# EAGLE design sensor-tiny2313a (EAGLE 6.4)
Assembly variants: LCD, NOLCD
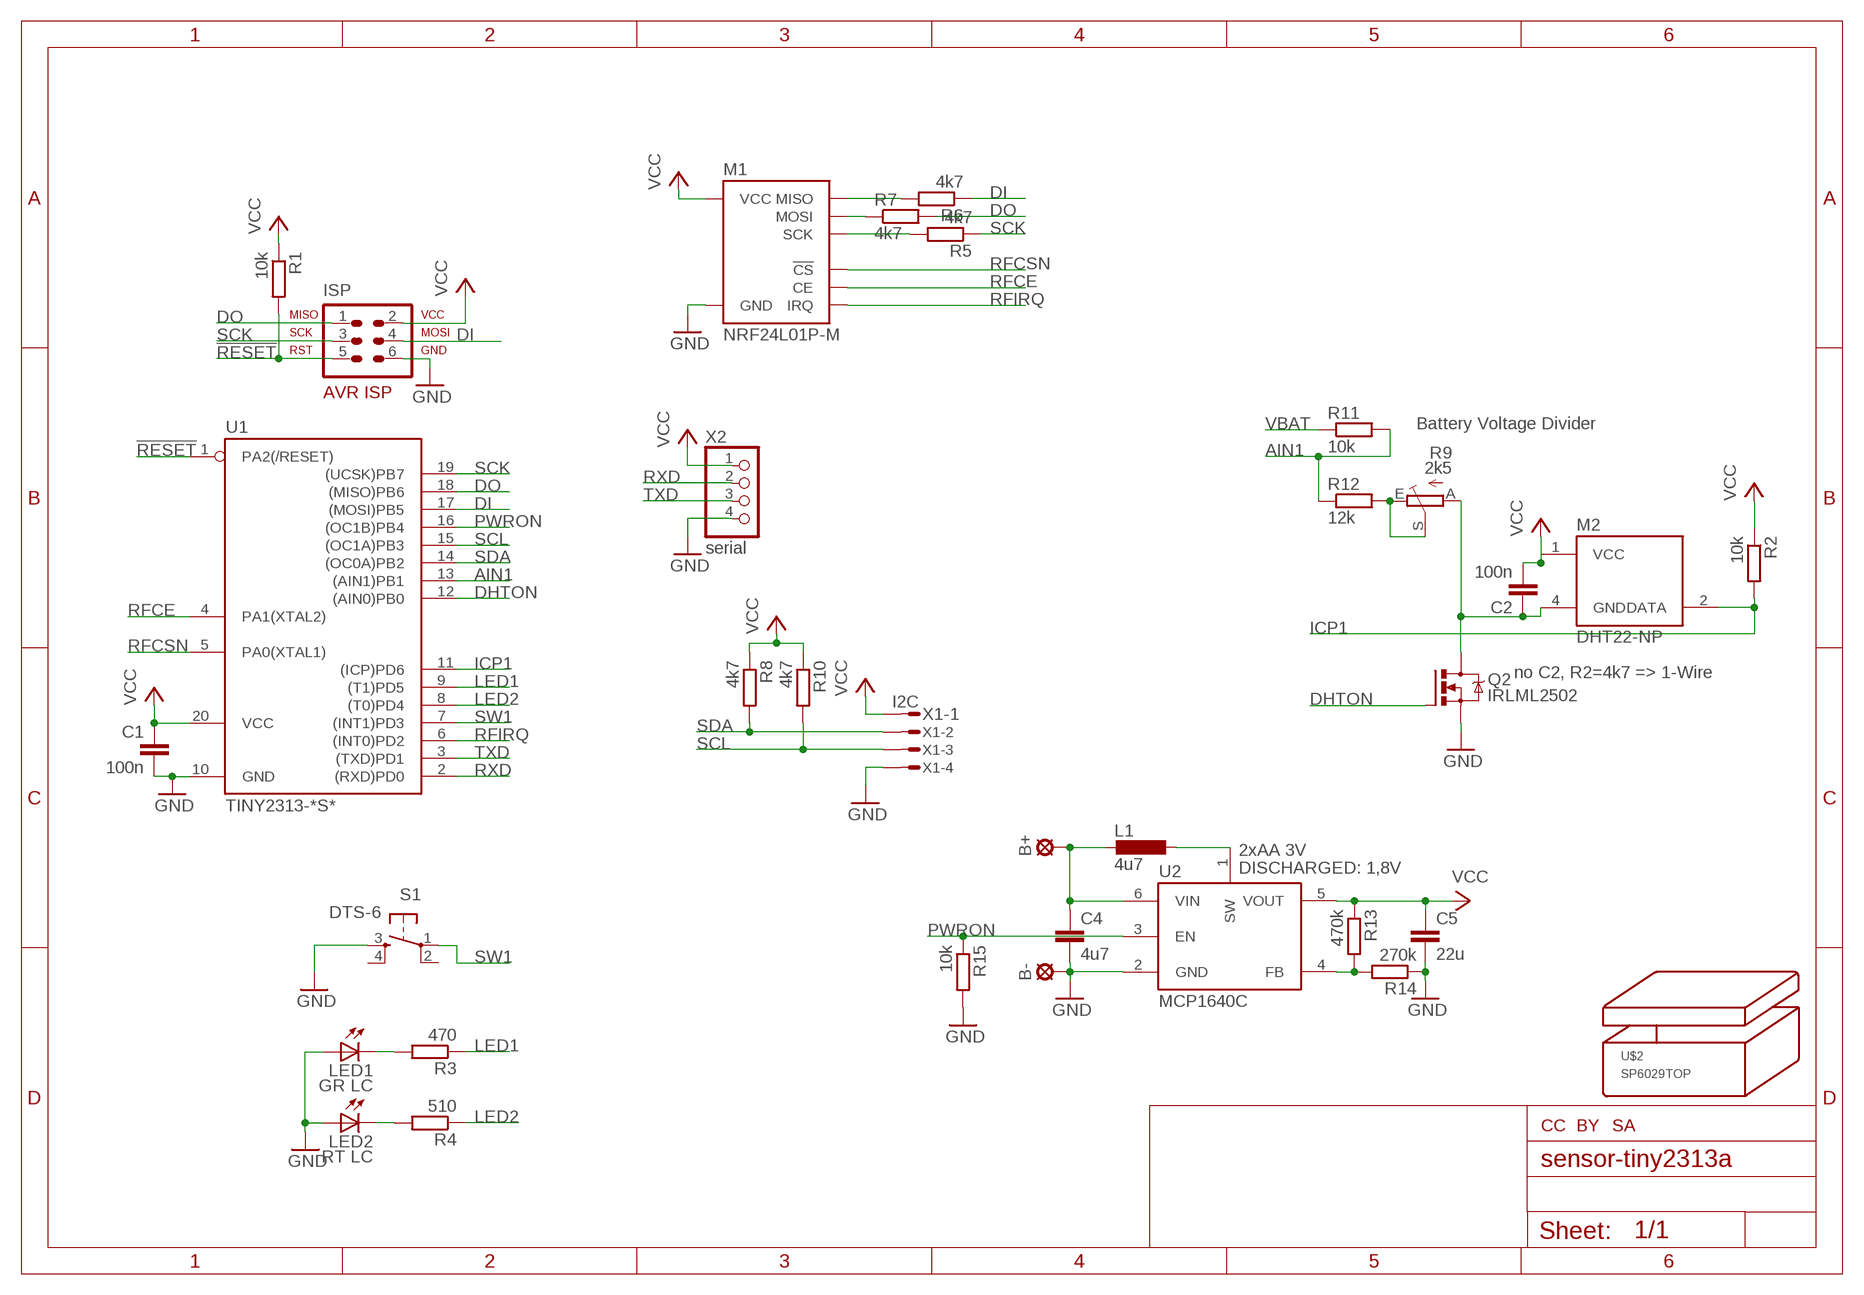
[diagram p0: schematic, sheet 1]

## Parts
B+  LSP11  [LSP11]
B-  LSP11  [LSP11]
C1  100n  C-EUC0603  [C0603]
C2  100n  C-EUC0603  [C0603]
C4  4u7  C-EUC0805  [C0805]
C5  22u  C-EUC1206  [C1206]
ISP  ML6  AVR-ISP-6VERT  [AVR-ISP-6]
L1  4u7  L-EUPISG  [PISG]
LED1  GR LC  LED5MM  [LED5MM]
LED2  RT LC  LED5MM  [LED5MM]
M1  NRF24L01P-M  [NRF24L01P-A]
M2  DHT22-NP  [DHT22-NOPRINT]
Q2  IRLML2502  [MICRO3]
R1  10k  R-EU_R0603  [R0603]
R2  10k  R-EU_R0603  [R0603]
R3  470  R-EU_R0603  [R0603]
R4  510  R-EU_R0603  [R0603]
R5  4k7  R-EU_R0603  [R0603]
R6  4k7  R-EU_R0603  [R0603]
R7  4k7  R-EU_R0603  [R0603]
R8  4k7  R-EU_R0603  [R0603]
R9  2k5  TRIM_EU-CA6H  [CA6H]
R10  4k7  R-EU_R0603  [R0603]
R11  10k  R-EU_R0603  [R0603]
R12  12k  R-EU_R0603  [R0603]
R13  470k  R-EU_R0603  [R0603]
R14  270k  R-EU_R0603  [R0603]
R15  10k  R-EU_R0603  [R0603]
S1  DTS-6  [DTS-6]
U1  TINY2313-*S*  [SO20L$]
U2  MCP1640C  MCP1640  [SOT23-6]
U$1  CC-TPLACE-HALF  [CC_TPLACE_HS]
U$2  SP6029TOP  [SP6029T]
U$3  BY-TPLACE-HS  [BY_TPLACE_HS]
U$4  SA-TPLACE-HALF  [SA_TPLACE_HS]
X1  I2C  MICROMATCH-4  [MICROMATCH-4]
X2  serial  PINHD-1X4_2.54  [1X04]

## Nets
!RESET: ISP.5 R1.2 U1.1(PA2(/RESET))
AIN1: R11.2 R12.1 U1.13((AIN1)PB1)
DHTON: Q2.1(G) U1.12((AIN0)PB0)
DI: ISP.4 R6.1 U1.17((MOSI)PB5)
DO: ISP.1 R7.2 U1.18((MISO)PB6)
GND [pwr]: B-.MP C1.2 C4.2 C5.2 ISP.6 LED1.A LED2.A M1.GND_A(GND) M1.GND_B(GND) Q2.2(S) R14.1 R15.2 S1.3 U1.10(GND) U2.2(GND) X1.4 X2.4
ICP1: M2.2(DATA) R2.2 U1.11((ICP)PD6)
LED1: R3.1 U1.9((T1)PD5)
LED2: R4.1 U1.8((T0)PD4)
N$1: LED2.K(C) R4.2
N$2: C2.1 M2.4(GND) Q2.3(D) R9.A
N$3: LED1.K(C) R3.2
N$7: R9.E R9.S R12.2
N$8: L1.1 U2.1(SW)
N$9: R13.2 R14.2 U2.4(FB)
PWRON: R15.1 U1.16((OC1B)PB4) U2.3(EN)
RDI: M1.MISO R6.2
RDO: M1.MOSI R7.1
RFCE: M1.CE U1.4(PA1(XTAL2))
RFCSN: M1.CSN(!CS) U1.5(PA0(XTAL1))
RFIRQ: M1.IRQ U1.6((INT0)PD2)
RSCK: M1.SCK R5.2
RXD: U1.2((RXD)PD0) X2.2
SCK: ISP.3 R5.1 U1.19((UCSK)PB7)
SCL: R10.2 U1.15((OC1A)PB3) X1.3
SDA: R8.2 U1.14((OC0A)PB2) X1.2
SW1: S1.1 U1.7((INT1)PD3)
TXD: U1.3((TXD)PD1) X2.3
VBAT [pwr]: B+.MP C4.1 L1.2 R11.1 U2.6(VIN)
VCC [pwr]: C1.1 C2.2 C5.1 ISP.2 M1.VCC_A(VCC) M1.VCC_B(VCC) M2.1(VCC) R1.1 R2.1 R8.1 R10.1 R13.1 U1.20(VCC) U2.5(VOUT) X1.1 X2.1
Unconnected: S1.2 S1.4

## Notes on the sheet
- Battery Voltage Divider
- no C2, R2=4k7 => 1-Wire
- 2xAA 3V
- DISCHARGED: 1,8V

## Library data of the parts
B+ B- = solpad:LSP11: SOLDER PAD drill 1.1 mm
C1 C2 = rcl:C-EU: CAPACITOR, European symbol
C4 = rcl:C-EU: CAPACITOR, European symbol; _REICHELT_: X7R-G0805 4,7/16
C5 = rcl:C-EU: CAPACITOR, European symbol; _REICHELT_: X7R-G1206 22/10
ISP = avr-7:AVR-ISP-6: AVR ISP-6 Serial Programming Header
L1 = inductor-Fastron:L-EU; _REICHELT_: L-PISG 4,7µ
LED1 = led:LED: LED OSRAM: - CHIPLED LG R971, LG N971, LY N971, LG Q971, LY Q971, LO R971, LY R971 LH N974, LH R974 LS Q976, LO Q976, LY Q976 LO Q996 - Hyper CHIPLED LW Q18S LB Q993, LB Q99A, LB R99A - SideLED LS A670, LO A670, LY A670, LG A670, LP A670 LB A673, LV A673, LT A673, LW A673 LH A674 LY A675 LS A676, LA A676, LO A676, LY A676, LW A676 LS A679, LY A679, LG A679 - Hyper Micro SIDELED® LS Y876, LA Y876, LO Y876, LY Y876 LT Y87S - SmartLED LW L88C, LW L88S LB L89C, LB L89S, LG L890 LS L89K, LO L89K, LY L89K LS L896, LA L896, LO L896, LY L896 - TOPLED LS T670, LO T670, LY T670, LG T670, LP T670 LSG T670, LSP T670, LSY T670, LOP T670, LYG T670 LG T671, LOG T671, LSG T671 LB T673, LV T673, LT T673, LW T673 LH T674 LS T676, LA T676, LO T676, LY T676, LB T676, LH T676, LSB T676, LW T676 LB T67C, LV T67C, LT T67C, LS T67K, LO T67K, LY T67K, LW E67C LS E67B, LA E67B, LO E67B, LY E67B, LB E67C, LV E67C, LT E67C LW T67C LS T679, LY T679, LG T679 LS T770, LO T770, LY T770, LG T770, LP T770 LB T773, LV T773, LT T773, LW T773 LH T774 LS E675, LA E675, LY E675, LS T675 LS T776, LA T776, LO T776, LY T776, LB T776 LHGB T686 LT T68C, LB T68C - Hyper Mini TOPLED® LB M676 - Mini TOPLED Santana® LG M470 LS M47K, LO M47K, LY M47K Source: http://www.osram.convergy.de LUXEON: - LUMILED® LXK2-PW12-R00, LXK2-PW12-S00, LXK2-PW14-U00, LXK2-PW14-V00 LXK2-PM12-R00, LXK2-PM12-S00, LXK2-PM14-U00 LXK2-PE12-Q00, LXK2-PE12-R00, LXK2-PE12-S00, LXK2-PE14-T00, LXK2-PE14-U00 LXK2-PB12-K00, LXK2-PB12-L00, LXK2-PB12-M00, LXK2-PB14-N00, LXK2-PB14-P00, LXK2-PB14-Q00 LXK2-PR12-L00, LXK2-PR12-M00, LXK2-PR14-Q00, LXK2-PR14-R00 LXK2-PD12-Q00, LXK2-PD12-R00, LXK2-PD12-S00 LXK2-PH12-R00, LXK2-PH12-S00 LXK2-PL12-P00, LXK2-PL12-Q00, LXK2-PL12-R00 Source: www.luxeon.com KINGBRIGHT: KA-3528ASYC Source: www.kingbright.com; I: 2.2mA; U_F: 2V2
LED2 = led:LED: LED OSRAM: - CHIPLED LG R971, LG N971, LY N971, LG Q971, LY Q971, LO R971, LY R971 LH N974, LH R974 LS Q976, LO Q976, LY Q976 LO Q996 - Hyper CHIPLED LW Q18S LB Q993, LB Q99A, LB R99A - SideLED LS A670, LO A670, LY A670, LG A670, LP A670 LB A673, LV A673, LT A673, LW A673 LH A674 LY A675 LS A676, LA A676, LO A676, LY A676, LW A676 LS A679, LY A679, LG A679 - Hyper Micro SIDELED® LS Y876, LA Y876, LO Y876, LY Y876 LT Y87S - SmartLED LW L88C, LW L88S LB L89C, LB L89S, LG L890 LS L89K, LO L89K, LY L89K LS L896, LA L896, LO L896, LY L896 - TOPLED LS T670, LO T670, LY T670, LG T670, LP T670 LSG T670, LSP T670, LSY T670, LOP T670, LYG T670 LG T671, LOG T671, LSG T671 LB T673, LV T673, LT T673, LW T673 LH T674 LS T676, LA T676, LO T676, LY T676, LB T676, LH T676, LSB T676, LW T676 LB T67C, LV T67C, LT T67C, LS T67K, LO T67K, LY T67K, LW E67C LS E67B, LA E67B, LO E67B, LY E67B, LB E67C, LV E67C, LT E67C LW T67C LS T679, LY T679, LG T679 LS T770, LO T770, LY T770, LG T770, LP T770 LB T773, LV T773, LT T773, LW T773 LH T774 LS E675, LA E675, LY E675, LS T675 LS T776, LA T776, LO T776, LY T776, LB T776 LHGB T686 LT T68C, LB T68C - Hyper Mini TOPLED® LB M676 - Mini TOPLED Santana® LG M470 LS M47K, LO M47K, LY M47K Source: http://www.osram.convergy.de LUXEON: - LUMILED® LXK2-PW12-R00, LXK2-PW12-S00, LXK2-PW14-U00, LXK2-PW14-V00 LXK2-PM12-R00, LXK2-PM12-S00, LXK2-PM14-U00 LXK2-PE12-Q00, LXK2-PE12-R00, LXK2-PE12-S00, LXK2-PE14-T00, LXK2-PE14-U00 LXK2-PB12-K00, LXK2-PB12-L00, LXK2-PB12-M00, LXK2-PB14-N00, LXK2-PB14-P00, LXK2-PB14-Q00 LXK2-PR12-L00, LXK2-PR12-M00, LXK2-PR14-Q00, LXK2-PR14-R00 LXK2-PD12-Q00, LXK2-PD12-R00, LXK2-PD12-S00 LXK2-PH12-R00, LXK2-PH12-S00 LXK2-PL12-P00, LXK2-PL12-Q00, LXK2-PL12-R00 Source: www.luxeon.com KINGBRIGHT: KA-3528ASYC Source: www.kingbright.com; I: 2mA; U_F: 2V
M1 = modules:NRF24L01P-M
M2 = modules:DHT22
Q2 = mosfet:IRLML2502: HEXFET N-Channel Power MOSFET http://www.irf.com/product-info/datasheets/data/irlml2502.pdf
R1-R8 R10-R15 = rcl:R-EU_: RESISTOR, European symbol
R9 = pot:TRIM_EU-: POTENTIOMETER
S1 = switch-tact:DTS-6
U1 = avr-7:TINY2313*: Atmel Tiny2313 2K Flash, 128 bytes EEPROM, 128 bytes RAM
U2 = karlnet-parts:MCP1640: MCP1623, 1624, 1640/B/C/D pwm/pfm or pwm only DC/DC converters, in SOT-23
U$1 = creative-commons:CC: creatice commons - CC
U$2 = strapubox:SP6029: Gehäuse Strapubox Typ 6029 Montage Deckel max. Bauteilhöhe, top-layer: 7,5 mm max. Bauteilhöhe, bottom-layer: 10 mm (Dicke der LP: 1,5 mm) Montage Boden max. Bauteilhöhe, top-layer: 12,5 mm max. Bauteilhöhe, bottom-layer: 5 mm (Dicke der LP: 1,5 mm) Außenmaße: Länge: 80 mm Breite: 61 mm Höhe: 23 mm Innenmaße: Länge: 75 mm Breite: 56 mm Höhe: 19 mm Mit Batteriefach 2xAA/9V
U$3 = creative-commons:BY: creative commons Attribution - BY
U$4 = creative-commons:SA: creative commons ShareAlike - SA
X1 = con-amp-micromatch:MICROMATCH-4: MicroMaTch 4 7-215464-4 / 0-215464-4 Drawing Number C-215464 DDEController.pdf
X2 = pinhead-mod:PINHD-1X4: PIN HEADER

## Net classes
0 default: width 0.2 mm, drill 0.8 mm
1 pwr: width 0.25 mm, drill 0.8 mm

## Board
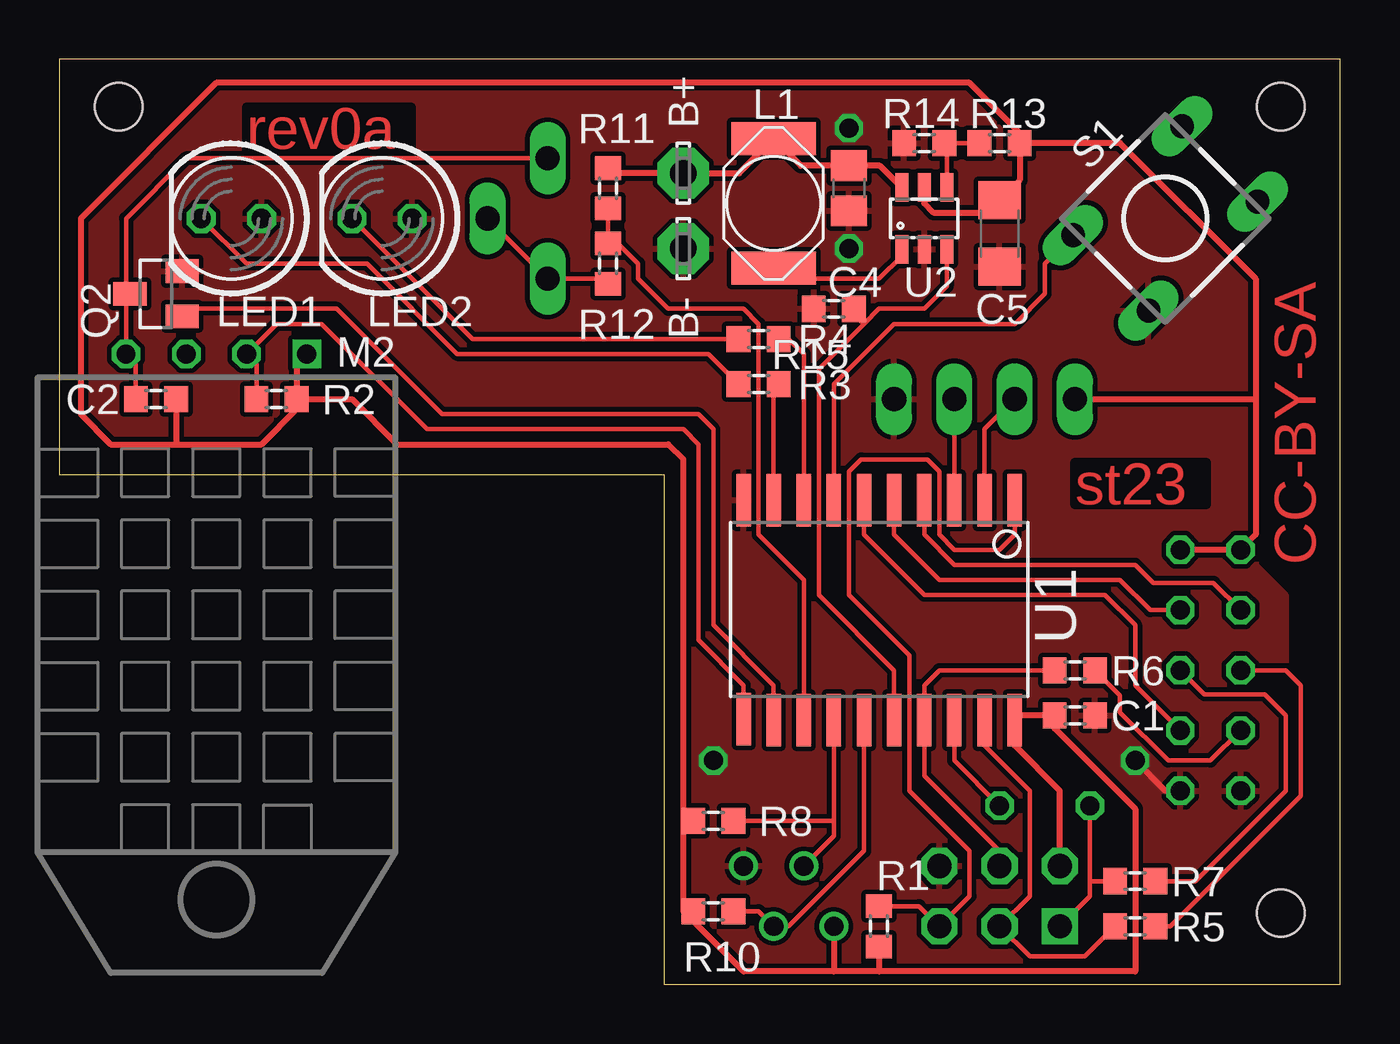
[diagram p1: board, top side]
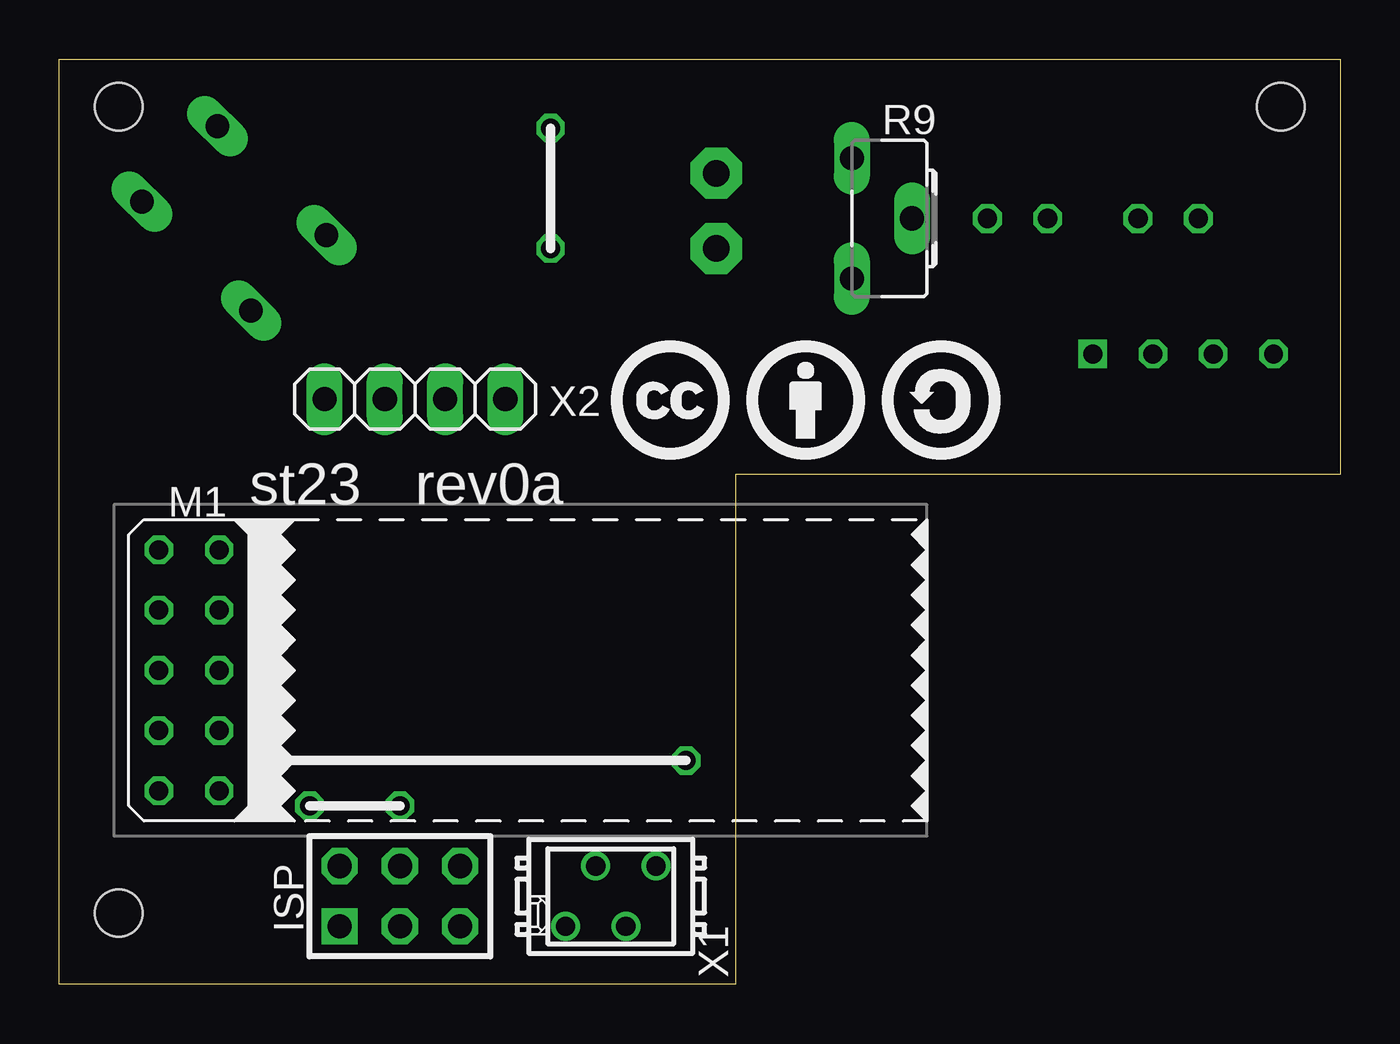
[diagram p2: board, bottom side, seen from below]

Size 54 x 39 mm. Coordinates in mm from the lower left corner, seen from the top.
Outline: 25.5,0 54,0 54,39 0,39 0,21.5 25.5,21.5 25.5,0
Copper layers (1*16): Top 0.035mm / dielectric 1.5mm / Bottom 0.035mm
Design rules "pcb-devboards_Standard *": minimum track width 0.2mm, minimum drill 0.4mm, track to track 0.2mm, track to pad 0.2mm, pad to pad 0.2mm, via to via 0.2mm, smd to smd 0.2mm, copper to edge 0.4mm, drill to drill 0.2mm, minimum pad ring 0.2mm, minimum via ring 0.2mm, stop-mask expansion 0.1mm, vias tented up to drill 0mil, thermal gap 0.2mm
Holes 2 mm at 51.5,3 51.5,37 2.5,37
bKeepout: area 23.5,23.5 to 30.8,30.5; area 25.5,30 to 28.5,36

### Footprints (pad centres in the part's own frame; a part is rotated, then mirrored left to right if it is on the bottom)
LSP11 = drill 1.118 pad 2.159 octagon: MP 0,0
C0603 = smd 1 x 1.1: 1 -0.85,0; 2 0.85,0
C0805 = smd 1.3 x 1.5: 1 -0.95,0; 2 0.95,0
C1206 = smd 1.6 x 1.8: 1 -1.4,0; 2 1.4,0
AVR-ISP-6 = drill 1.016 square: 1 -2.54,-1.27 | drill 1.016 octagon: 2 -2.54,1.27; 3 0,-1.27; 4 0,1.27; 5 2.54,-1.27; 6 2.54,1.27
PISG = smd 1.4 x 3.56: 1 -2.73,0; 2 2.73,0
LED5MM = drill 0.813 octagon: A -1.27,0; K 1.27,0
NRF24L01P-A = drill 0.8 octagon: CE -2.54,-1.27; CSN -2.54,1.27; GND_A 5.08,1.27; GND_B 5.08,-1.27; IRQ 2.54,1.27; MISO 2.54,-1.27; MOSI 0,1.27; SCK 0,-1.27; VCC_A -5.08,1.27; VCC_B -5.08,-1.27
DHT22-NOPRINT = drill 0.8 square: 1 -3.81,0 | drill 0.8 octagon: 2 -1.27,0; 3 1.27,0; 4 3.81,0
MICRO3 = smd 1 x 1.4: 1 -0.95,-1.1; 2 0.95,-1.1; 3 0,1.1
R0603 = smd 1 x 1.1: 1 -0.85,0; 2 0.85,0
CA6H = drill 1.016 long: A -2.54,0; E 2.54,0; S 0,2.54
DTS-6 = drill 1 long: 1 -3.25,2.25; 2 3.25,2.25; 3 -3.25,-2.25; 4 3.25,-2.25
SO20L$ = smd 0.61 x 2.21: 1 -5.715,-4.636; 2 -4.445,-4.636; 3 -3.175,-4.636; 4 -1.905,-4.636; 5 -0.635,-4.636; 6 0.635,-4.636; 7 1.905,-4.636; 8 3.175,-4.636; 9 4.445,-4.636; 10 5.715,-4.636; 11 5.715,4.61; 12 4.445,4.636; 13 3.175,4.636; 14 1.905,4.636; 15 0.635,4.636; 16 -0.635,4.636; 17 -1.905,4.636; 18 -3.175,4.636; 19 -4.445,4.636; 20 -5.715,4.636
SOT23-6 = smd 0.55 x 1.2: 1 -0.95,-1.3; 2 0,-1.3; 3 0.95,-1.3; 4 0.95,1.3; 5 0,1.3; 6 -0.95,1.3
MICROMATCH-4 = drill 0.813: 1 1.905,1.27; 2 0.635,-1.27; 3 -0.635,1.27; 4 -1.905,-1.27
1X04 = drill 1.016 long: 1 -3.81,0; 2 -1.27,0; 3 1.27,0; 4 3.81,0

### Placement (x,y rotation side)
B+  26.3,34.2 90 top
B-  26.3,31.02 90 top
C1  42.81,11.34 0 top
C2  4.08,24.67 0 top
C4  33.29,33.56 270 top
C5  39.64,31.66 270 top
ISP  39.64,3.71 0 bottom
L1  30.11,32.92 90 top
LED1  7.26,32.29 180 top
LED2  13.61,32.29 180 top
M1  48.53,13.24 270 bottom
M2  6.62,26.57 180 top
Q2  4.08,29.11 90 top
R1  34.56,2.45 90 top
R2  9.16,24.67 180 top
R3  29.48,25.3 180 top
R4  29.48,27.21 180 top
R5  45.35,2.45 0 top
R6  42.81,13.24 0 top
R7  45.35,4.35 180 top
R8  27.57,6.89 0 top
R9  20.59,32.29 270 bottom
R10  27.57,3.08 0 top
R11  23.13,33.56 270 top
R12  23.13,30.38 270 top
R13  39.64,35.47 180 top
R14  36.47,35.47 0 top
R15  32.66,28.48 180 top
S1  46.62,32.29 45 top
U1  34.56,15.78 180 top
U2  36.47,32.29 0 top
U$1  30.75,22.13 0 bottom
U$2  -1,-2 0 top
U$3  25.04,22.13 0 bottom
U$4  19.32,22.13 0 bottom
X1  30.75,3.71 180 bottom
X2  39.01,24.67 0 bottom

### Tracks (layer width: path | path; a pad name or v marks a point on that pad's centre or on a via)
!RESET
  Top 0.2: U1.1 40.27,18.95 39.64,18.32 37.73,18.32 37.1,18.95 37.1,21.62 36.59,22.13 33.8,22.13 33.29,21.62 33.29,16.41 35.83,13.88 35.83,8.16 38.37,5.62 38.37,3.71 ISP.5 36.25,3.29 R1.2
AIN1
  Top 0.2: R11.2 R12.1 23.55,31.23 24.4,30.38 24.4,29.75 25.67,28.48 28.84,28.48 29.48,27.84 29.48,18.95 31.38,17.05 U1.13
DHTON
  Top 0.2: U1.12 30.11,12.61 27.57,15.14 27.57,23.4 26.94,24.04 16.14,24.04 11.7,28.48 5.5,28.48 Q2.1
DI
  Top 0.2: R6.1 37.1,13.24 36.47,12.61 U1.17 36.47,8.79 39.64,5.62 ISP.4
DO  (via drill 0.8)
  Top 0.2: ISP.1 43.45,3.71 43.45,4.35 | 43.45,4.35 v43.45,7.53 | v39.64,7.53 37.73,9.43 U1.18 | R7.2 43.45,4.35
  Bottom 0.2: v43.45,7.53 v39.64,7.53
GND  (via drill 0.8)
  Top 0.25: M1.GND_A 46.62,8.16 v45.35,9.43
  Bottom 0.25: v33.29,36.1 v33.29,31.02 | v45.35,9.43 v27.57,9.43
  pour Top: -2.27,38.01 42.81,38.01 50.44,30.38 50.44,17.68 51.7,16.41 51.7,6.26 43.45,-2 -2.27,-2
ICP1
  Top 0.2: R2.2 8.31,26.16 M2.2 9.16,27.84 11.06,27.84 15.51,23.4 26.3,23.4 26.94,22.77 26.94,14.51 28.84,12.61 28.84,11.34 29.01,11.17 U1.11
LED1
  Top 0.2: U1.9 30.11,25.09 R3.1
LED2
  Top 0.2: U1.8 31.38,26.57 30.75,27.21 R4.1
N$1
  Top 0.2: R4.2 17.41,27.21 LED2.K
N$2
  Top 0.2: M2.4 3.23,26.16 C2.1 3.23,24.25 | M2.4 2.98,26.75 | R9.A 5.35,34.83 2.81,32.29 2.81,29.11 | 2.81,29.11 M2.4 | Q2.3 2.81,29.11
N$3
  Top 0.2: LED1.K 7.89,30.38 12.97,30.38 16.78,26.57 27.36,26.57 R3.2
N$7
  Top 0.2: R9.S R9.E 22.91,29.75 R12.2
N$8
  Top 0.2: U2.1 35.52,30.7 34.56,29.75 30.56,29.75 L1.1
N$9
  Top 0.2: U2.4 37.41,35.37 R14.2 R13.2
PWRON
  Top 0.2: U2.3 37.41,29.43 36.47,28.48 34.56,28.48 33.92,27.84 | U1.16 35.2,13.24 32.02,16.41 32.02,25.94 33.92,27.84 | R15.1 33.29,28.48 33.92,27.84
RDI
  Top 0.2: M1.MISO 48.53,9.43 46.75,9.43 44.72,11.46 44.72,12.19 R6.2
RDO
  Top 0.2: M1.MOSI 48.28,12.22 50.82,12.22 51.7,11.34 51.7,8.16 47.9,4.35 R7.1
RFCE
  Top 0.2: M1.CE 48.66,16.92 46.12,16.92 45.35,17.68 37.73,17.68 36.47,18.95 U1.4
RFCSN
  Top 0.2: M1.CSN 45.99,15.78 44.72,17.05 37.1,17.05 35.2,18.95 U1.5
RFIRQ
  Top 0.2: M1.IRQ 45.35,12.61 45.35,15.14 44.09,16.41 36.47,16.41 33.92,18.95 U1.6
RSCK
  Top 0.2: M1.SCK 51.7,13.24 52.34,12.61 52.34,7.95 46.84,2.45 R5.2
RXD
  Top 0.2: U1.2 39.01,23.4 X2.2
SCK
  Top 0.2: U1.19 39.01,10.06 40.91,8.16 40.91,3.71 ISP.3 40.91,1.17 43.23,1.17 R5.1
SCL
  Top 0.2: U1.15 33.92,5.62 30.75,2.45 X1.3 29.48,3.08 R10.2
SDA
  Top 0.2: X1.2 32.66,6.26 32.66,6.89 | 32.66,6.89 U1.14 | R8.2 32.66,6.89
SW1
  Top 0.2: U1.7 32.66,25.3 35.2,27.84 40.27,27.84 41.55,29.11 41.55,30.39 S1.1
TXD
  Top 0.2: U1.3 X2.3
VBAT
  Top 0.25: U2.6 34.59,34.51 C4.1 31.26,34.51 L1.2 28.66,34.2 B+.MP 23.34,34.2 R11.1
VCC
  Top 0.25: U2.5 36.47,32.92 36.85,32.54 39.13,32.54 C5.1 40.49,33.91 R13.1 | M2.1 10.01,26.16 R2.1 | ISP.2 42.18,8.16 40.27,10.06 U1.20 40.47,11.34 C1.1 41.97,10.79 45.35,7.4 45.35,0.54 34.56,0.54 | M1.VCC_A M1.VCC_B 50.44,18.95 50.44,24.67 | R2.1 12.34,24.67 14.24,22.77 25.67,22.77 26.3,22.13 26.3,6.89 | 4.93,22.77 2.17,22.77 0.91,24.04 0.91,32.29 6.62,38.01 38.37,38.01 40.49,35.88 R13.1 | 4.93,22.77 8.53,22.77 10.01,24.25 R2.1 | 50.44,24.67 50.44,29.75 44.72,35.47 R13.1 | X2.1 50.44,24.67 | 34.56,0.54 32.66,0.54 | 32.66,0.54 28.84,0.54 26.62,2.76 | 40.27,35.47 R13.1 | 26.3,6.89 26.3,3.08 26.62,2.76 | R1.1 34.56,0.54 | X1.1 32.66,0.54 | R10.1 26.73,2.87 26.62,2.76 | C2.2 4.93,22.77 | R8.1 26.3,6.89

### Text on the board
Top: CC-BY-SA